# Altium project radon-sense-hardware.PrjPcb
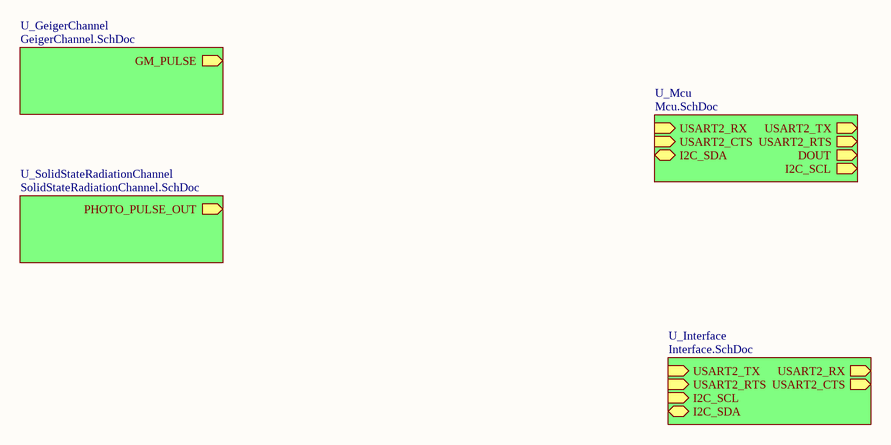
[diagram p0: SchemaBloc.SchDoc]
6 sheets, 129 parts. Net scope: hierarchical (ports join the sheet entries above them; power ports are global).
Board file: ES_Class6C_2L.PcbDoc
Sheets:
  SchemaBloc.SchDoc
    U_GeigerChannel = GeigerChannel.SchDoc
    U_SolidStateRadiationChannel = SolidStateRadiationChannel.SchDoc
    U_Mcu = Mcu.SchDoc
    U_Interface = Interface.SchDoc
  Power.SchDoc

## Sheet SchemaBloc.SchDoc
size A3; Date: 26.01.2022; Author: Ali Zoubir; CompanyName: ETML-ES; DrawnBy: Ali Zoubir; Engineer: Ali Zoubir; Organization: ETML-ES; Address1: Avenue Recordon 1; Address2: 1004 Lausanne; Address3: Switzerland; Revision: 1924B; SheetNumber: 1; SheetTotal: 4; Version: V0

### Sub-sheets
U_GeigerChannel = GeigerChannel.SchDoc: GM_PULSE (out)
U_Interface = Interface.SchDoc: USART2_TX (in), USART2_RX (out), USART2_RTS (in), USART2_CTS (out), I2C_SCL (in), I2C_SDA (bidir)
U_Mcu = Mcu.SchDoc: USART2_TX (out), USART2_RX (in), USART2_RTS (out), USART2_CTS (in), DOUT (out), I2C_SCL (out), I2C_SDA (bidir)
U_SolidStateRadiationChannel = SolidStateRadiationChannel.SchDoc: PHOTO_PULSE_OUT (out)

### Notes on the sheet
- Fichier :
- a
- Date :
- Heure :
- Version :
- Auteur :
- Modif.
- b
- c
- d
- Projet :
- No :
- Nb feuilles
- Feuille n°
- Chemin :

## Sheet GeigerChannel.SchDoc
size A3; Author: Ali Zoubir; Organization: ETML-ES; Address1: Avenue Recordon 1; Address2: 1004 Lausanne; Address3: Switzerland; Revision: 1924B; SheetNumber: 2; SheetTotal: 4; SPICEModelCacheGNAZWADN: <root> / <DocumentId>GNAZWADN</DocumentId> / </root>; Version: V0
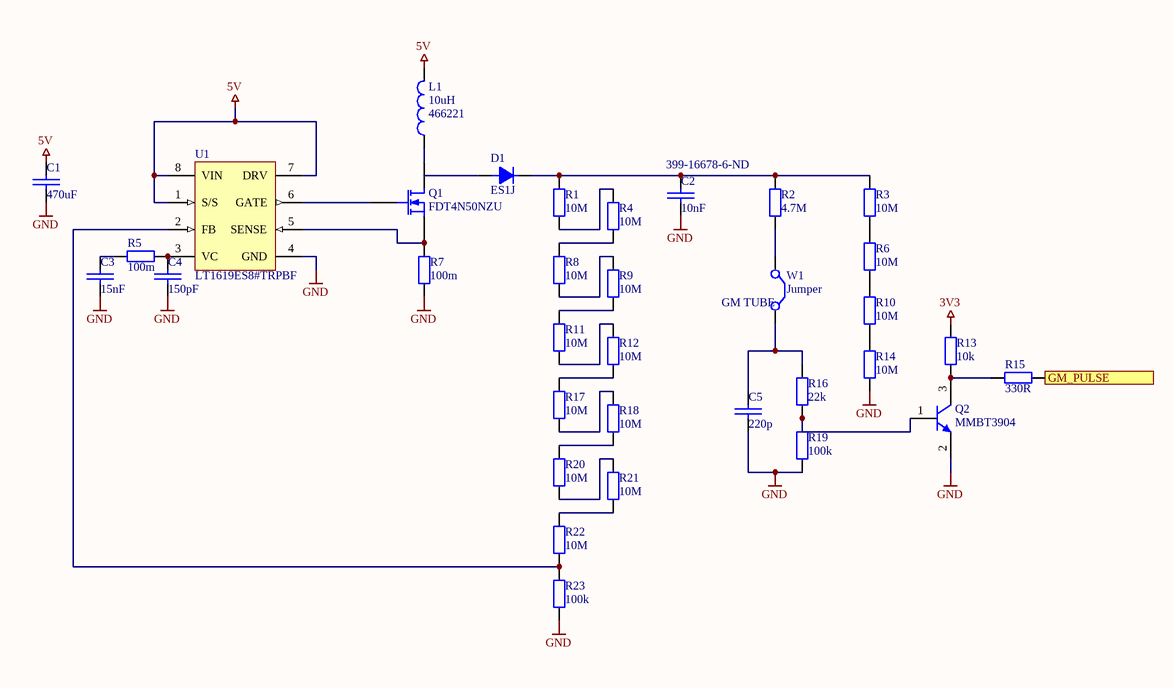
[diagram p1: GeigerChannel.SchDoc]

### Parts
C1  470uF  [Cap_0805]
C2  10nF  Supplier Part Number 1: 399-16678-6-ND  [1206]
C3  15nF  [Cap_0805]
C4  150pF  [Cap_0805]
C5  220p  [1206]
D1  ES1J  [DIOM5227X250N]
L1  10uH  Supplier Part Number 1: 466221  [SRN3015C]
Q1  FDT4N50NZU  [SOT-223]
Q2  MMBT3904  [FAIR-SOT23-3_V]
R1  10M  [RES_0805]
R2  4.7M  [RES_0805]
R3  10M  [RES_0805]
R4  10M  [RES_0805]
R5  100m  [RES_0805]
R6  10M  [RES_0805]
R7  100m  [RES_0805]
R8  10M  [RES_0805]
R9  10M  [RES_0805]
R10  10M  [RES_0805]
R11  10M  [RES_0805]
R12  10M  [RES_0805]
R13  10k  [RES_0805]
R14  10M  [RES_0805]
R15  330R  [RES_0805]
R16  22k  [RES_0805]
R17  10M  [RES_0805]
R18  10M  [RES_0805]
R19  100k  [RES_0805]
R20  10M  [RES_0805]
R21  10M  [RES_0805]
R22  10M  [RES_0805]
R23  100k  [RES_0805]
U1  LT1619ES8#TRPBF  [LT-S8-8_N]
W1  Jumper  [RAD-0.2]

### Ports
GM_PULSE (out)

### Nets
3V3: R13.1
5V: C1.1 L1.2 U1.1(S/S) U1.7(DRV) U1.8(VIN)
GND: C1.2 C2.2 C3.2 C4.2 C5.2 Q2.2(E) R7.2 R14.2 R19.2 R23.2 U1.4(GND)
NetC2_1: C2.1 D1.1(A) R1.1 R2.1 R3.1
NetC3_1: C3.1 R5.1
NetC4_1: C4.1 R5.2 U1.3(VC)
NetC5_1: C5.1 R16.1 W1.2(C2)
NetL1_1: L1.1 Q1.D
NetQ1_G: Q1.G U1.6(GATE)
NetQ1_S: Q1.S R7.1 U1.5(SENSE)
NetQ2_1: Q2.1(B) R16.2 R19.1
NetQ2_3: Q2.3(C) R13.2 R15.1
NetR1_2: R1.2 R4.1
NetR2_2: R2.2 W1.1(C1)
NetR3_2: R3.2 R6.1
NetR4_2: R4.2 R8.1
NetR6_2: R6.2 R10.1
NetR8_2: R8.2 R9.1
NetR9_2: R9.2 R11.1
NetR10_2: R10.2 R14.1
NetR11_2: R11.2 R12.1
NetR12_2: R12.2 R17.1
NetR15_2: R15.2 ; port GM_PULSE
NetR17_2: R17.2 R18.1
NetR18_2: R18.2 R20.1
NetR20_2: R20.2 R21.1
NetR21_2: R21.2 R22.1
NetR22_2: R22.2 R23.1 U1.2(FB)

Not connected (* = marked no-connect by the designer): D1 2(B)

### Notes on the sheet
- (near W1) GM TUBE
- Fichier :
- a
- Date :
- Heure :
- Version :
- Auteur :
- Modif.
- b
- c
- d
- Projet :
- No :
- Nb feuilles
- Feuille n°
- Chemin :

### Library data of the parts
C1-C5 = C: SDTSourceLibName: C:\WINDOWS\TEMP\DA.LIB; PCB Footprint: RC0805
  C2 C5: Supplier 1: DigiKey
D1 = ES1J: Ð”Ð¸Ð¾Ð´, ÑÐ²ÐµÑ€Ñ…Ð±Ñ‹ÑÑ‚Ñ€Ñ‹Ð¹, SMA, 600 Ð’, 1 Ð, 35 Ð½Ñ, 150 Â°C; MF: Diotec Semiconductor; SnapEDA_Link: https://www.snapeda.com/parts/ES1J/Diotec/view-part/?ref=snap; Package: DO-214AC Diotec; Value: *; MP: ES1J; Check_prices: https://www.snapeda.com/parts/ES1J/Diotec/view-part/?ref=eda
L1 = Inductor: Code_IEC: 1005; Published: 8-Jun-2000; LatestRevisionDate: 29-May-2009; LatestRevisionNote: IPC-7351 Footprint Added.; PackageReference: 0402-A; Publisher: Altium Limited; PackageDescription: Chip Inductor; Code_JEITA: 0402; Value: 10uH; Supplier 1: RS
Q2 = CMP-1670-00008-1: NPN General Purpose Amplifier, 40 V, 0.2 A, -55 to 150 degC, 3-Pin SOT23, RoHS, Tape and Reel; Tolerance: 30ppm; Capacitance: 1.8E-11 f; Frequency: 12.288 MHz; ESR: 40 Ohm; Load Capacitance: 18 pF; REACH SVHC: No SVHC; Pins: 4; ComponentLink3URL: http://www.fairchildsemi.com/dwg/MA/MA03D.pdf; PackageDescription: 3-Pin Small Outline Transistor, Body 2.92 x 1.325 mm, Pitch 0.95 mm; ComponentLink1URL: https://www.fairchildsemi.com/; Max Operating Temperature: 70degC; PackageReference: SOT23-3; ComponentLink1Description: Manufacturer URL; Width: 0.126 inch; Min Operating Temperature: -20degC; DatasheetVersion: Rev. 1.1.0, 10/2014; Mount: Surface Mount; Height: 0.041 inch; Package Quantity: 1000; Frequency Tolerance: 30ppm; Packaging: Tape and Reel; ComponentLink2URL: https://www.fairchildsemi.com/datasheets/MM/MMBT3904.pdf; RoHSCompliant: True; ComponentLink3Description: Package Specification; ComponentLink2Description: Datasheet; Length: 0.197 inch
R1-R23 = CMP-2001-00528-1: Res 0805; Part Number: ERJ6ENF2703V; Manufacturer: Panasonic
U1 = CMP-0491-01756-1: Low Voltage Current Mode PWM Controller, 8-pin SOIC (S8-8), -40 to 85 degC, Pb-Free, Tape and Reel; Manufacturer: Linear Technology; Number of Outputs: 1; ComponentLink1Description: Manufacturer URL; Packing: Tape and Reel; ComponentLink2Description: Datasheet; ComponentLink2URL: http://cds.linear.com/docs/en/datasheet/1619fa.pdf; ComponentLink1URL: http://www.linear.com/; Mounting Technology: Surface Mount; RoHS: TRUE; ComponentLink3URL: http://cds.linear.com/docs/en/packaging/05081610_G_SO8.pdf; PackageReference: S8-8; PackageVersion: Rev. G, 03/2012; DatasheetVersion: Rev. A; ComponentLink3Description: Package Specification; PartNumber: LT1619ES8#TRPBF; PackageDescription: 8-Pin Plastic Small Outline (Narrow .150 Inch), Body 4.9 x 3.9 mm, Pitch 1.27 mm
W1 = Jumper: Jumper Wire; Published: 24-Mar-1999; LatestRevisionDate: 17-Jul-2002; LatestRevisionNote: Re-released for DXP Platform.; PackageReference: RAD-0.2; Publisher: Altium Limited; PackageDescription: Radial Cap, Thru-Hole; 2 Leads; 0.2 in Pin Spacing

## Sheet SolidStateRadiationChannel.SchDoc
size A3; Author: Ali Zoubir; Organization: ETML-ES; Address1: Avenue Recordon 1; Address2: 1004 Lausanne; Address3: Switzerland; Revision: 1924B; SheetNumber: 3; SheetTotal: 4; Version: V0
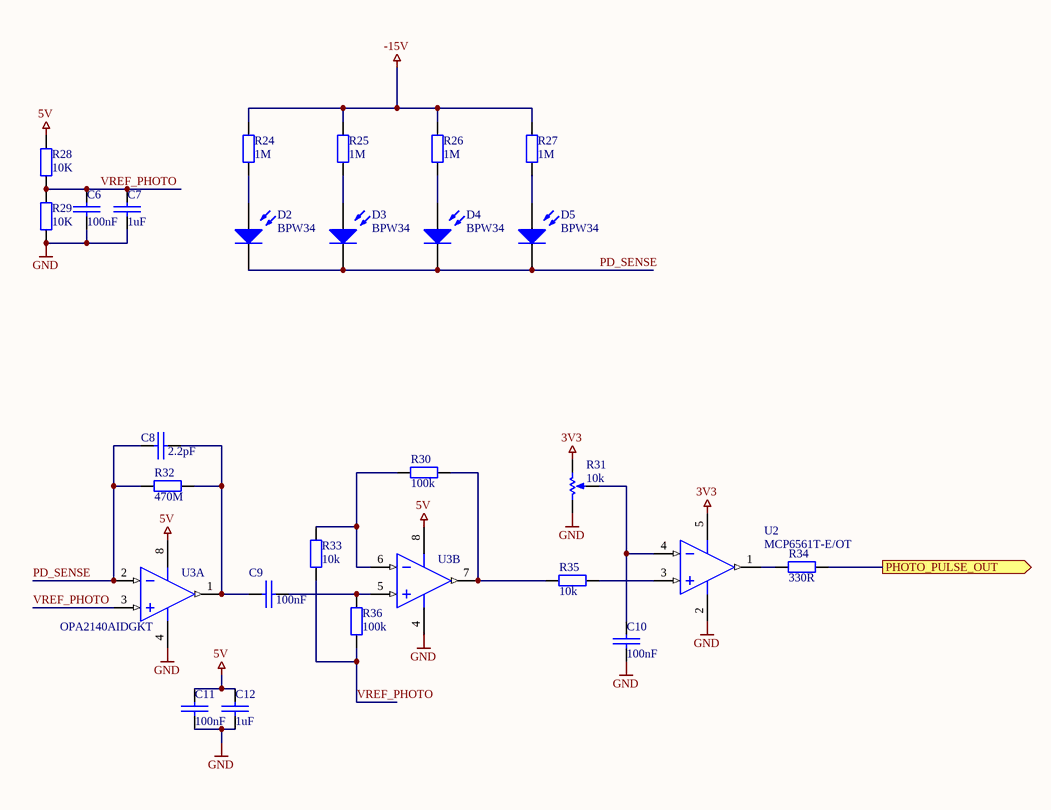
[diagram p2: SolidStateRadiationChannel.SchDoc]

### Parts
C6  100nF  [Cap_0805]
C7  1uF  [Cap_0805]
C8  2.2pF  [Cap_0805]
C9  100nF  [Cap_0805]
C10  100nF  [Cap_0805]
C11  100nF  [Cap_0805]
C12  1uF  [Cap_0805]
D2  BPW34  [BPW34]
D3  BPW34  [BPW34]
D4  BPW34  [BPW34]
D5  BPW34  [BPW34]
R24  1M  [RES_0805]
R25  1M  [RES_0805]
R26  1M  [RES_0805]
R27  1M  [RES_0805]
R28  10K  [RES_0805]
R29  10K  [RES_0805]
R30  100k  [RES_0805]
R31  10k  [VR5]
R32  470M  [RES_0805]
R33  10k  [RES_0805]
R34  330R  [RES_0805]
R35  10k  [RES_0805]
R36  100k  [RES_0805]
U2  MCP6561T-E/OT  [SOT-23-OT5_L]
U3  OPA2140AIDGKT  [DGK0008A_N]  (parts A,B of 2)

### Ports
PHOTO_PULSE_OUT (out)

### Nets
3V3: R31.1(TOP) U2.5(VDD)
5V: C11.1 C12.1 R28.1 U3.8(V+)
-15V: R24.1 R25.1 R26.1 R27.1
GND: C6.2 C7.2 C10.1 C11.2 C12.2 R29.2 R31.2(BOT) U2.2(VSS) U3.4(V-)
PD_SENSE: C8.1 D2.2(K) D3.2(K) D4.2(K) D5.2(K) R32.1 U3.2(IN_A-)
VREF_PHOTO: C6.1 C7.1 R28.2 R29.1 R33.2 R36.2 U3.3(IN_A+)
NetC8_2: C8.2 C9.1 R32.2 U3.1(OUT_A)
NetC9_2: C9.2 R36.1 U3.5(IN_B+)
NetC10_2: C10.2 R31.3(TAP) U2.4(IN-)
NetD2_1: D2.1(A) R24.2
NetD3_1: D3.1(A) R25.2
NetD4_1: D4.1(A) R26.2
NetD5_1: D5.1(A) R27.2
NetR30_1: R30.1 R33.1 U3.6(IN_B-)
NetR30_2: R30.2 R35.1 U3.7(OUT_B)
NetR34_1: R34.1 U2.1(OUT)
NetR34_2: R34.2 ; port PHOTO_PULSE_OUT
NetR35_2: R35.2 U2.3(IN+)

### Notes on the sheet
- Fichier :
- a
- Date :
- Heure :
- Version :
- Auteur :
- Modif.
- b
- c
- d
- Projet :
- No :
- Nb feuilles
- Feuille n°
- Chemin :

### Library data of the parts
C6-C12 = C: as C1 on sheet GeigerChannel
D2-D5 = BPW34: Silicon PIN Photodiode
R24-R30 R32-R36 = CMP-2001-00528-1: as R1 on sheet GeigerChannel
R31 = RPot: Potentiometer; Sim Note: Enter the Resistance value and the set point into parameter fields.; Set Position: 0.5; Published: 8-Jun-2000; LatestRevisionDate: 17-Jul-2002; LatestRevisionNote: Re-released for DXP Platform.; PackageReference: VR5; Publisher: Altium Limited; PackageDescription: Variable Resistor, Thru-Hole; 3 Leads; Value: 10k
U2 = CMP-0187-00042-3: None; Input Bias Current: 1pA; Hysteresis: 5mV; Output Type: TTL; Propagation Delay: 80ns; Output Current per Channel: 25mA; Max Supply Voltage: 5.5V; Power Supply Rejection Ratio (PSRR): 70dB; Response Time: 49ns; Nominal Supply Current: 130uA; Common Mode Rejection Ratio: 66dB; Natural Thermal Resistance: 256°C/W; Number of Elements: 1; Input Offset Voltage (Vos): 10mV; Output Current: 50mA; Min Supply Voltage: 1.8V; Case/Package: SOT-23; Packaging: Tape and Reel; Radiation Hardening: No; Width: 1.8mm; RoHS Compliant: Yes; Package Quantity: 3000; Min Operating Temperature: -40°C; Lead Free: Lead Free; Technology: CMOS; Max Operating Temperature: 125°C; Mount: Surface Mount; REACH SVHC: No SVHC; Max Supply Current: 130uA; Length: 3.1mm; Type: General Purpose; Number of Pins: 5; Contact Plating: Tin; Number of Channels: 1; Height: 1.3mm; Quiescent Current: 130uA; Max Input Current: 1pA; Supply Current: 130uA; Turn-On Delay Time: 49ns
U3 = CMP-0272-01237-3: 11 MHz, Precision, Low Noise, Rail-to-Rail Output, JFET Operational Amplifier, 4.5 to 36 V, -40 to 125 degC, 8-pin SOP (DGK8), Green (RoHS & no Sb/Br); Manufacturer: Texas Instruments; Offset Drift(Typ)(uV/C): 0.35; Rating: Catalog; GBW(Typ)(MHz): 11; Total Supply Voltage(Min)(+5V is 5, +/-5V is 10): 4.5; Slew Rate(Typ)(V/us): 20; Vio (25C)(Max)(mV): 0.12; Total Supply Voltage(Max)(+5V is 5, +/-5V is 10): 36; CMRR(Min)(dB): 126; Iq per channel(Max)(mA): 2; Packing: SMALL T&R; Sub Family: High Supply Voltage Amplifier (>=30V), Low Input Bias Current Amp (<=10pA), Low Noise Amp (<=10nV/rtHz), Low Offset Voltage Amplifier (<=500uV), Precision Amplifier; IIB(Max)(pA): 10; ComponentLink2URL: http://www.ti.com/lit/ds/symlink/opa2140.pdf; Eco-Plan: Green (RoHS & no Sb/Br); ComponentLink1Description: Manufacturer URL; ComponentLink2Description: Datasheet; Code_JEDEC: MO-187; ComponentLink3Description: Package Specification; PackageReference: DGK0008A; PartNumber: OPA2140AIDGKT; ComponentLink3URL: http://www.ti.com/litv/pdf/mpds028d; PackageDescription: 8-Pin Thin Small Outline, Body 3 x 3 mm, Pitch 0.65 mm; PackageVersion: 4073329/E, 05/2006; DatasheetVersion: SBOS498A; Number of Channels: 2; ComponentLink1URL: http://www.ti.com/; Mounting Technology: Surface Mount

## Sheet Mcu.SchDoc
size A4
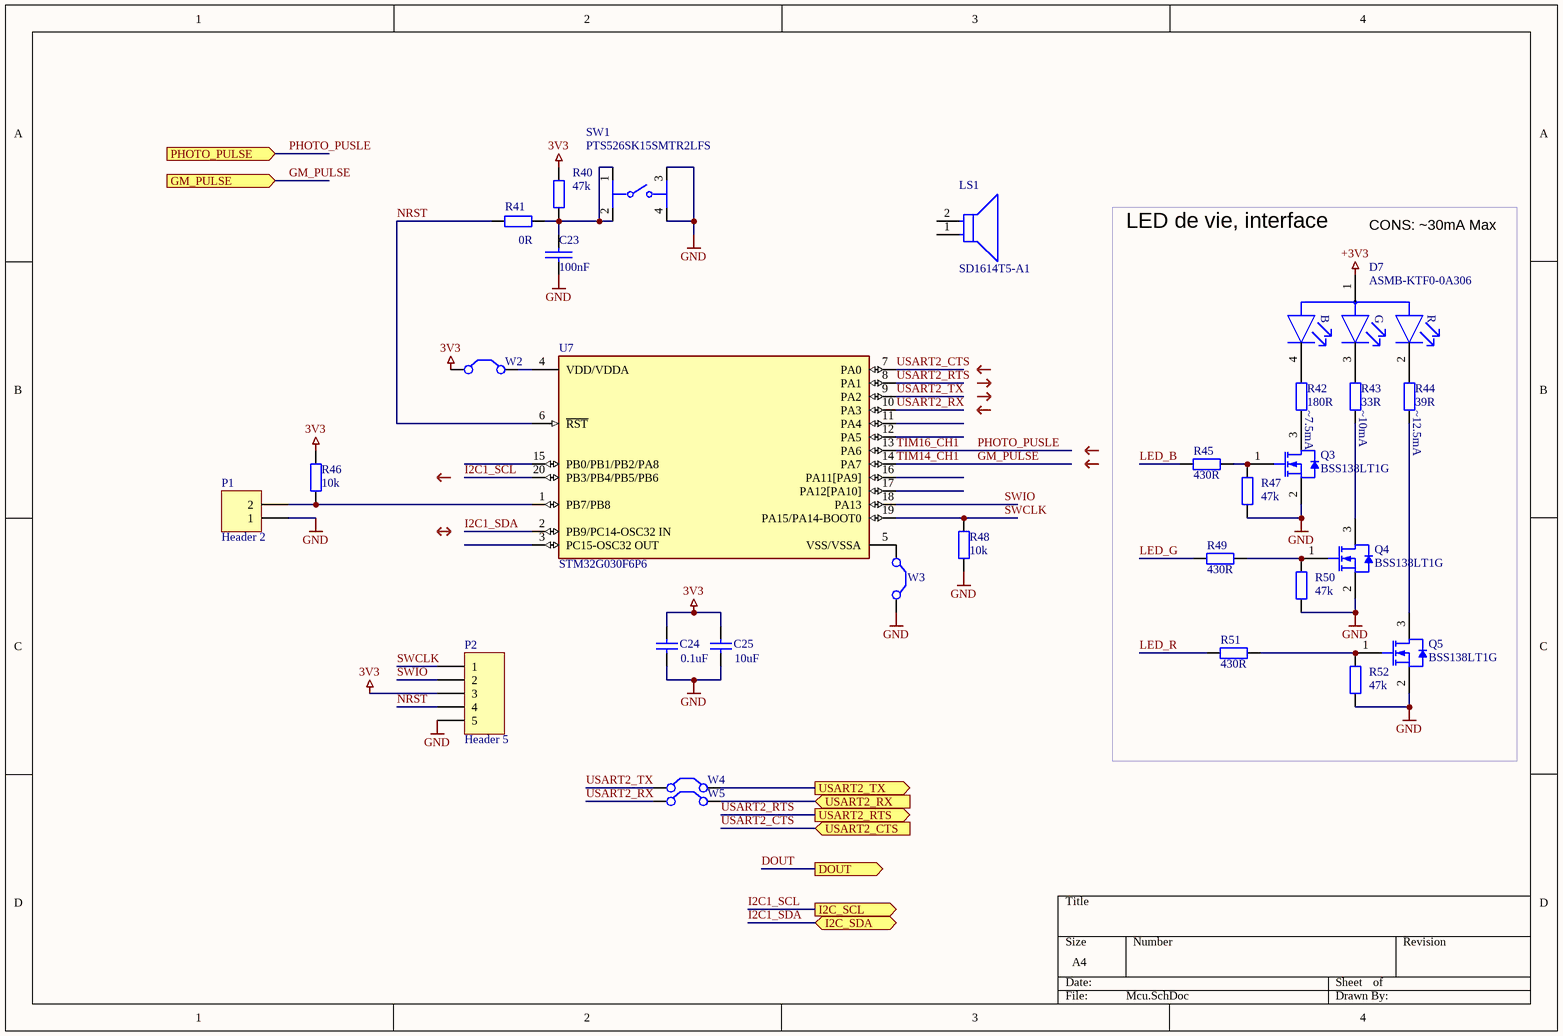
[diagram p3: Mcu.SchDoc]

### Parts
C23  100nF  [Cap_0805]
C24  0.1uF  [Cap_0805]
C25  10uF  [Cap_0805]
D7  ASMB-KTF0-0A306  [FP-PLCC-4-MFG]
LS1  SD1614T5-A1  [FP-SD1614T5-A1-MFG]
P1  Header 2  [HDR1X2]
P2  Header 5  [HDR1X5]
Q3  BSS138LT1G  [ONSC-SOT-23-3-318-08_V]
Q4  BSS138LT1G  [ONSC-SOT-23-3-318-08_V]
Q5  BSS138LT1G  [ONSC-SOT-23-3-318-08_V]
R40  47k  [RES_0805]
R41  0R  [RES_0805]
R42  value 180R  [RES_0805]  (hidden comment: 430R)
R43  value 33R  [RES_0805]  (hidden comment: 430R)
R44  value 39R  [RES_0805]  (hidden comment: 430R)
R45  430R  [RES_0805]
R46  10k  [RES_0805]
R47  value 47k  [RES_0805]  (hidden comment: 10k)
R48  10k  [RES_0805]
R49  430R  [RES_0805]
R50  value 47k  [RES_0805]  (hidden comment: 10k)
R51  430R  [RES_0805]
R52  value 47k  [RES_0805]  (hidden comment: 10k)
SW1  PTS526SK15SMTR2LFS  [FP-PTS526SK15SMTR2LFS-MFG]
U7  STM32G030F6P6  [FP-TSSOP20-YA-MFG]
W2  Jumper  [JUMPER]  (value not drawn)
W3  Jumper  [JUMPER]  (value not drawn)
W4  Jumper  [JUMPER]  (value not drawn)
W5  Jumper  [JUMPER]  (value not drawn)

### Blocks framed on the sheet
LED de vie, interface: D7 Q3-Q5 R42-R45 R47 R49-R52

### Ports
DOUT (out), GM_PULSE (in), I2C_SCL (out), I2C_SDA (bidir), PHOTO_PULSE (in), USART2_CTS (in), USART2_RTS (out), USART2_RX (in), USART2_TX (out)

### Nets
3V3: C24.2 C25.2 P2.3 R40.1 R46.2 W2.1(C1)
+3V3: D7.1(A)
GND: C23.2 C24.1 C25.1 P1.1 P2.5 Q3.2(S) Q4.2(S) Q5.2(S) R47.1 R48.1 R50.1 R52.1 SW1.3 SW1.4 W3.2(C2)
DOUT: port DOUT
GM_PULSE: U7.14(PA7) ; port GM_PULSE  [also labelled TIM14_CH1]
I2C1_SCL: U7.20(PB3/PB4/PB5/PB6) ; port I2C_SCL
I2C1_SDA: U7.2(PB9/PC14-OSC32_IN) ; port I2C_SDA
LED_B: R45.2
LED_G: R49.2
LED_R: R51.2
NRST: P2.4 R41.1 U7.6(~{RST})
PHOTO_PUSLE: U7.13(PA6) ; port PHOTO_PULSE  [also labelled TIM16_CH1]
SWCLK: P2.1 R48.2 U7.19(PA15/PA14-BOOT0)
SWIO: P2.2 U7.18(PA13)
USART2_CTS: U7.7(PA0) ; port USART2_CTS
USART2_RTS: U7.8(PA1) ; port USART2_RTS
USART2_RX: U7.10(PA3) W5.1(C1)
USART2_TX: U7.9(PA2) W4.1(C1)
NetC23_1: C23.1 R40.2 R41.2 SW1.1 SW1.2
NetD7_2: D7.2(Red_C) R44.1
NetD7_3: D7.3(Green_C) R43.1
NetD7_4: D7.4(Blue_C) R42.1
NetP1_2: P1.2 R46.1 U7.1(PB7/PB8)
NetQ3_1: Q3.1(G) R45.1 R47.2
NetQ3_3: Q3.3(D) R42.2
NetQ4_1: Q4.1(G) R49.1 R50.2
NetQ4_3: Q4.3(D) R43.2
NetQ5_1: Q5.1(G) R51.1 R52.2
NetQ5_3: Q5.3(D) R44.2
NetU7_4: U7.4(VDD/VDDA) W2.2(C2)
NetU7_5: U7.5(VSS/VSSA) W3.1(C1)
NetW4_2: W4.2(C2) ; port USART2_TX
NetW5_2: W5.2(C2) ; port USART2_RX

Not connected (* = marked no-connect by the designer): LS1 1(C) 2(A); U7 3(PC15-OSC32_OUT) 11(PA4) 12(PA5) 15(PB0/PB1/PB2/PA8) 16(PA11[PA9]) 17(PA12[PA10])

### Notes on the sheet
- CONS: ~30mA Max
- ~7.5mA
- (near R43) ~10mA
- (near R44) ~12.5mA
- (in symbol CMP-18399-000003-1) B; G; R

### Library data of the parts
C23 = C: as C1 on sheet GeigerChannel
C24 C25 = Cap: Capacitor; Published: 8-Jun-2000; LatestRevisionDate: 17-Jul-2002; LatestRevisionNote: Re-released for DXP Platform.; PackageReference: RAD-0.3; Publisher: Altium Limited; PackageDescription: Radial Cap, Thru-Hole; 2 Leads; 0.3 in Pin Spacing
  C24: Value: 0.1uF
  C25: Value: 10uF
D7 = CMP-18399-000003-1: LED RGB 4PLCC SMD; Manufacturer: Broadcom; Peak Emmision Wavelength: 467/518/628nm; Luminous Intensity: 215/1100/490mcd; Power Dissipation: 66/66/48mW; Led Orientation: Top View; Colour: Blue, Green, Red; Wavelength: 471/524/620nm; Forward Current: 10/15/15mA; Reverse Voltage: 4V; Viewing Angle: 110°; Forward Voltage: 2.85/2.95/2V; Max Junction Temp: +100°C; Digikey Description: LED RGB 4PLCC SMD; ComponentLink2URL: https://docs.broadcom.com/docs/ASMB-KTF0-0A306-DS100; ComponentLink2Description: Datasheet; Manufacturer Part Number: ASMB-KTF0-0A306; Temperature Range Low: -40°C; Device Class L2: LEDs; RoHS: TRUE; Octopart: https://octopart.com/asmb-ktf0-0a306-broadcom-87157377; Package: PLCC-4; Mouser Description: LED Multi-Color Chip Red/Green/Blue 620nm/524nm/471nm 20mA 4-Pin PLCC T/R; Category: Diode; Lead Free: Yes; Height: 2.1mm; Temperature: -40°C to +85°C; Device Class L1: Optoelectronics; Automotive: No; Temperature Range High: +85°C; Device Class L3: unset
LS1 = CMP-08413-000005-1: BUZZER MAGNETIC 5V 80DB 2048HZ 1; Frequency: 2.048kHz; Operating Supply Current: 80mA; Max Operating Temperature: 85°C; Min Operating Temperature: -40°C; Voltage Rating: 5V; Termination: PC Pins; Sensing Method: Magnetic; Mount: Panel
P1 = Header 2: Header, 2-Pin; LatestRevisionDate: 17-Jul-2002; LatestRevisionNote: Re-released for DXP Platform.; Publisher: Altium Limited
P2 = Header 5: Header, 5-Pin; LatestRevisionDate: 17-Jul-2002; LatestRevisionNote: Re-released for DXP Platform.; Publisher: Altium Limited
Q3-Q5 = CMP-1058-00767-1: Power MOSFET, 200 mA, 50 V, N-Channel, 3-Pin SOT-23, Pb-Free, Tape and Reel; Manufacturer: On Semiconductor; PD Max (W): 0.225; Coss Typ (pF): 12; V(BR)DSS Min (V): 50; VGS Max (V): 20; Channel Polarity: N Channel; Configuration: Single; VGS(th) Max (V): 1.5; Ciss Typ (pF): 40; Crss Typ (pF): 3.5; ID Max (A): 0.2; ComponentLink3Description: Package Specification; PackageDescription: 3-Pin Small Outline Transistor, Body 2.92 x 1.3 mm, Pitch 0.95 mm; PackageReference: SOT-23-3-318-08; RoHS: Pb-Free; Mounting Technology: Surface Mount; ComponentLink1Description: Manufacturer URL; ComponentLink2URL: http://www.onsemi.com/pub_link/Collateral/BSS138LT1-D.PDF; ComponentLink2Description: Datasheet; Packing: Tape and Reel; PackageVersion: Rev. AP, 11/2009; PartNumber: BSS138LT1G; Package Type: SOT-23-3; ComponentLink1URL: http://www.onsemi.com/; DatasheetVersion: Rev. 8; ComponentLink3URL: http://www.onsemi.cn/pub_link/Collateral/318-08.PDF
R40 R41 = Res2: Res 0805; Value: 1K; Published: 8-Jun-2000; LatestRevisionDate: 17-Jul-2002; LatestRevisionNote: Re-released for DXP Platform.; PackageReference: AXIAL-0.4; Publisher: Altium Limited; PackageDescription: Axial Device, Thru-Hole; 2 Leads; 0.4 in Pin Spacing
R42-R45 R47 R49-R52 = Res2: Res 0805; Published: 8-Jun-2000; LatestRevisionDate: 17-Jul-2002; LatestRevisionNote: Re-released for DXP Platform.; PackageReference: AXIAL-0.4; Publisher: Altium Limited; PackageDescription: Axial Device, Thru-Hole; 2 Leads; 0.4 in Pin Spacing
  R45 R49 R51: Value: 430R
R46 R48 = Res2: Resistor; Published: 8-Jun-2000; LatestRevisionDate: 17-Jul-2002; LatestRevisionNote: Re-released for DXP Platform.; PackageReference: AXIAL-0.4; Publisher: Altium Limited; PackageDescription: Axial Device, Thru-Hole; 2 Leads; 0.4 in Pin Spacing; Value: 10k
SW1 = CMP-10040-000013-1: TACT 5.2 X 5.2, 1.5 MM H, 260GF,; Manufacturer: C&K; Operating Force: 250gf; Throw Configuration: SPST-NO; Contact Current Rating: 50mA; Standoff Height: 0mm; Contact Resistance: 100mΩ; Voltage Rating Dc: 12V; Electromechanical Life: 200000Cycles; Device Class L3: Tactile Switches; Device Class L2: Switches; Temperature: -20°C to +70°C; Temperature Range Low: -20°C; Package: PTS526SK15SMTR2LFS; Temperature Range High: +70°C; ComponentLink2Description: Datasheet; Device Class L1: Electromechanical; Height: 1.65mm; Digikey Description: TACT 5.2 X 5.2, 1.5 MM H, 260GF,; Category: Switch; RoHS: TRUE; Automotive: No; Lead Free: Yes; Manufacturer Part Number: PTS526SK15SMTR2LFS; Octopart: https://octopart.com/pts526+sk15+smtr2+lfs-c%26k+components-100617999; ComponentLink2URL: https://www.ckswitches.com/media/2780/pts526.pdf
U7 = CMP-12105-000034-1: ARM MICROCONTROLLERS - MCU; Manufacturer: STMicroelectronics; Max Supply Voltage: 3.6V; Interface: I2C,SPI,USART,LIN,IrDA,I2S,SMBus; Memory Size: 32KBytes; Number Of I/Os: 17; Number Of Timers/Counters: 6; Core Architecture: ARM Cortex-M0+; Number Of Pwm Channels: 11; Standoff Height: 0.05mm; Number Of A/D Converters: 1; Number Of I2C Channels: 2; Data Bus Width: 32bits; Ram Size: 8KBytes; Max Junction Temp: +105°C; Number Of Spi Channels: 3; Min Supply Voltage: 2V; Number Of Adc Channels: 16; Memory Type: FLASH; Frequency: 64MHz; Ambient Temperature Range Low: -40°C; ComponentLink2URL: https://www.st.com/resource/en/datasheet/stm32g030f6.pdf; Temperature Range Low: -40°C; Automotive: No; Device Class L1: Integrated Circuits (ICs); Category: IC; Temperature Range High: +85°C; ComponentLink2Description: Datasheet; Device Class L2: Embedded Processors and Controllers; Manufacturer Part Number: STM32G030F6P6; Height: 1.2mm; Ambient Temperature Range High: +85°C; Octopart: https://octopart.com/stm32g030f6p6-stmicroelectronics-103773023; Package: TSSOP20-YA; Temperature: -40°C to +85°C; Lead Free: Yes; Device Class L3: Microcontrollers; Number Of Uart Channels: 2; RoHS: TRUE; Number Of Cores: 1; Digikey Description: ARM MICROCONTROLLERS - MCU
W2-W5 = Jumper: Jumper Wire; Published: 24-Mar-1999; LatestRevisionDate: 17-Jul-2002; LatestRevisionNote: Re-released for DXP Platform.; PackageReference: RAD-0.2; Publisher: Altium Limited; PackageDescription: Radial Cap, Thru-Hole; 2 Leads; 0.2 in Pin Spacing

## Sheet Interface.SchDoc
size A4
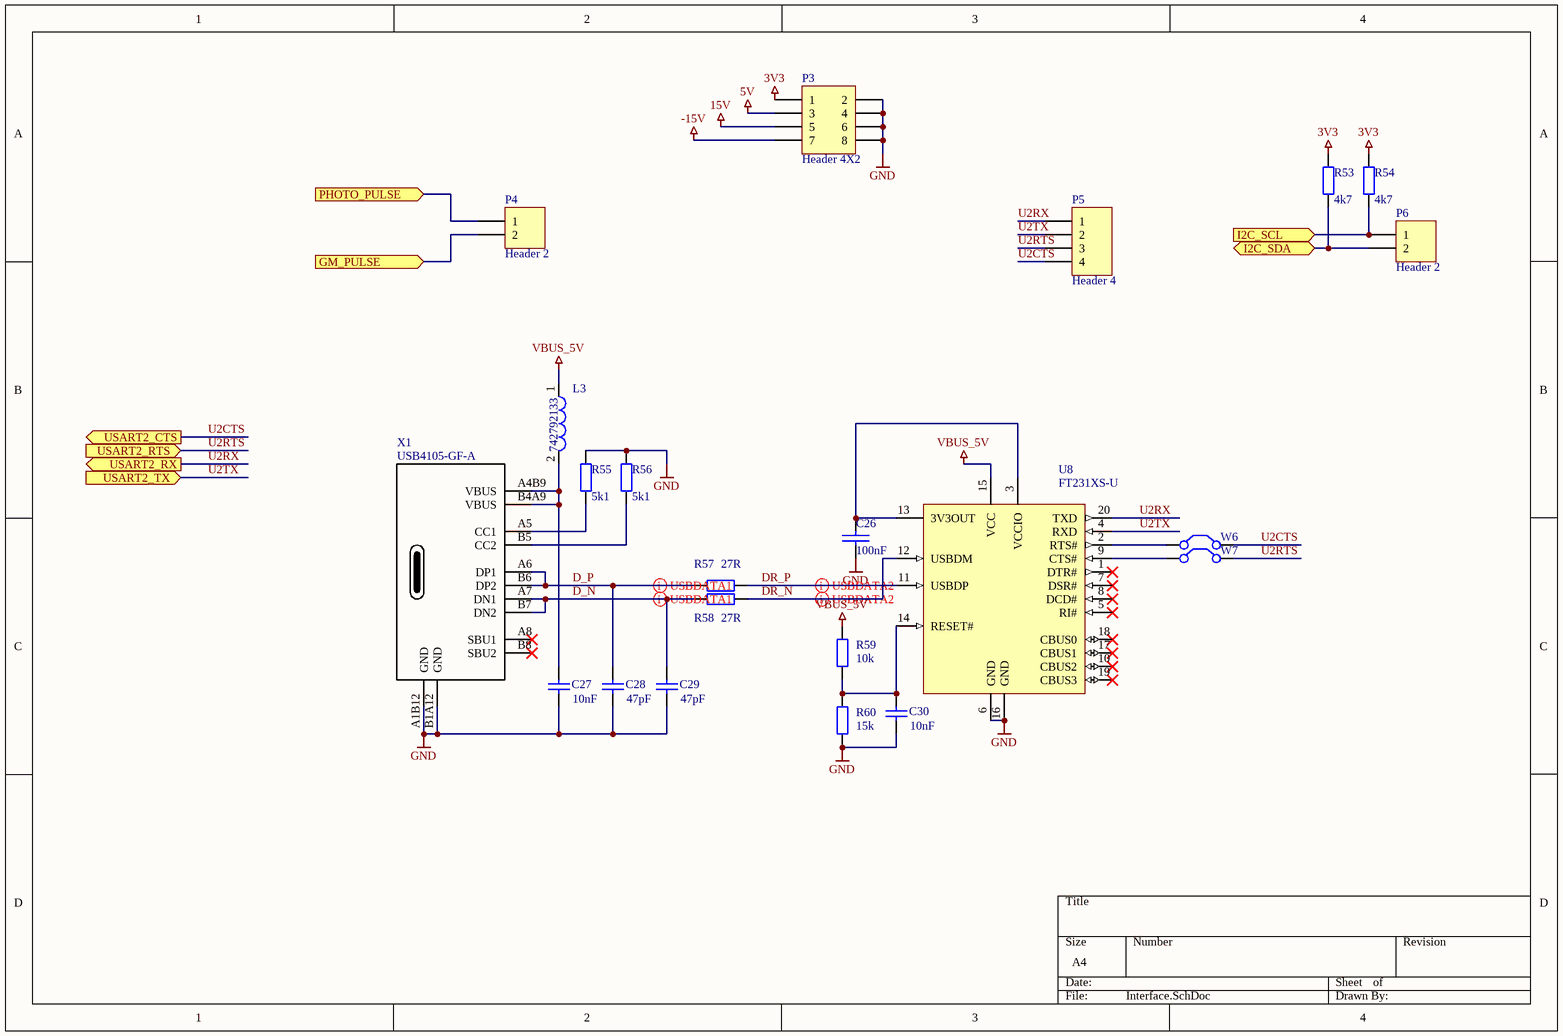
[diagram p4: Interface.SchDoc]

### Parts
C26  100nF  [Cap_0805]
C27  10nF  [6-0805_L]
C28  47pF  [6-0805_L]
C29  47pF  [6-0805_L]
C30  10nF  [Cap_0805]
L3  742792133  [SMD-1206]
P3  Header 4X2  [HDR2X4]
P4  Header 2  [HDR1X2]
P5  Header 4  [HDR1X4]
P6  Header 2  [HDR1X2]
R53  value 4k7  [RES_0805]  (hidden comment: 5k1)
R54  value 4k7  [RES_0805]  (hidden comment: 5k1)
R55  5k1  [RES_0805]
R56  5k1  [RES_0805]
R57  27R  [RES_0805]
R58  27R  [RES_0805]
R59  10k  [RES_0805]
R60  15k  [RES_0805]
U8  FT231XS-U  [SSOP-20_M]
W6  Jumper  [JUMPER]  (value not drawn)
W7  Jumper  [JUMPER]  (value not drawn)
X1  USB4105-GF-A  [GCT_USB4105-GF-A]

### Ports
GM_PULSE (in), I2C_SCL (in), I2C_SDA (bidir), PHOTO_PULSE (in), USART2_CTS (out), USART2_RTS (in), USART2_RX (out), USART2_TX (in)

### Nets
3V3: P3.1 R53.2 R54.2
5V: P3.3
15V: P3.5
-15V: P3.7
GND: C26.2 C27.1 C28.1 C29.1 C30.1 P3.2 P3.4 P3.6 P3.8 R55.2 R56.2 R60.1 U8.6(GND) U8.16(GND) X1.A1B12(GND) X1.B1A12(GND)
VBUS_5V: L3.1 R59.2 U8.15(VCC)
D_N: C29.2 R58.1 X1.A7(DN1) X1.B7(DN2)
D_P: C28.2 R57.1 X1.A6(DP1) X1.B6(DP2)
DR_N: R58.2 U8.12(USBDM)
DR_P: R57.2 U8.11(USBDP)
U2CTS: P5.4 W6.2(C2) ; port USART2_CTS
U2RTS: P5.3 W7.2(C2) ; port USART2_RTS
U2RX: P5.1 U8.20(TXD) ; port USART2_RX
U2TX: P5.2 U8.4(RXD) ; port USART2_TX
NetC26_1: C26.1 U8.3(VCCIO) U8.13(3V3OUT)
NetC27_2: C27.2 L3.2 X1.A4B9(VBUS) X1.B4A9(VBUS)
NetC30_2: C30.2 R59.1 R60.2 U8.14(RESET#)
NetP4_1: P4.1 ; port PHOTO_PULSE
NetP4_2: P4.2 ; port GM_PULSE
NetP6_1: P6.1 R54.1 ; port I2C_SCL
NetP6_2: P6.2 R53.1 ; port I2C_SDA
NetR55_1: R55.1 X1.A5(CC1)
NetR56_1: R56.1 X1.B5(CC2)
NetU8_2: U8.2(RTS#) W6.1(C1)
NetU8_9: U8.9(CTS#) W7.1(C1)

Not connected (* = marked no-connect by the designer): U8 1(DTR#)* 5(RI#)* 7(DSR#)* 8(DCD#)* 10(CBUS2)* 17(CBUS1)* 18(CBUS0)* 19(CBUS3)*; X1 A8(SBU1)* B8(SBU2)*

### Layout directives
differential pair: D_N, D_P, DR_N, DR_P

### Library data of the parts
C26 = C: as C1 on sheet GeigerChannel
C27-C30 = Cap: Capacitor; Published: 8-Jun-2000; LatestRevisionDate: 17-Jul-2002; LatestRevisionNote: Re-released for DXP Platform.; PackageReference: RAD-0.3; Publisher: Altium Limited; PackageDescription: Radial Cap, Thru-Hole; 2 Leads; 0.3 in Pin Spacing
  C27 C30: Value: 10nF
  C28 C29: Value: 47pF
L3 = CMP-0220-00010-1: SMD EMI Suppression Ferrite Bead WE-CBF, Z = 600 Ohm; Impedance: 600 Ohm; ComponentLink1Description: Manufacturer Link; DatasheetVersion: ver 2, Aug-2007; ComponentLink1URL: http://www.we-online.com; PackageDescription: Chip Inductor, 2-Leads, Body 3.2 x 1.6 mm; ComponentLink2URL: http://www.we-online.de/katalog/media/pdf/742792133.pdf; PackageVersion: 2007; PackageReference: SMD-1206; ComponentLink2Description: Datasheet
P3 = Header 4X2: Header, 4-Pin, Dual row; LatestRevisionDate: 17-Jul-2002; LatestRevisionNote: Re-released for DXP Platform.; Publisher: Altium Limited
P4 P6 = Header 2: Header, 2-Pin; LatestRevisionDate: 17-Jul-2002; LatestRevisionNote: Re-released for DXP Platform.; Publisher: Altium Limited
P5 = Header 4: Header, 4-Pin; LatestRevisionDate: 17-Jul-2002; LatestRevisionNote: Re-released for DXP Platform.; Publisher: Altium Limited
R53-R60 = Res2: Res 0805; Published: 8-Jun-2000; LatestRevisionDate: 17-Jul-2002; LatestRevisionNote: Re-released for DXP Platform.; PackageReference: AXIAL-0.4; Publisher: Altium Limited; PackageDescription: Axial Device, Thru-Hole; 2 Leads; 0.4 in Pin Spacing
  R55 R56: Value: 5k1
  R57 R58: Value: 27R
  R59: Value: 10k
  R60: Value: 15k
U8 = CMP-0248-00015-2: USB to Full-Handshake UART Interface Chip, UHCI/OHCI/EHCI Compatible, USB 2.0 Compatible, -40 to +85 degC, 20-Pin SSOP, Pb-Free, Tube; Manufacturer: FTDI; PackageDescription: 20-Pin Small Outline Package, 8.6 x 3.9 mm Body, 0.635 mm Pitch; ComponentLink2Description: Datasheet; DatasheetVersion: ver 1.2, Feb-2013; PackageReference: SSOP-20; ComponentLink3URL: www.ftdichip.com/Products/ICs/FT231X.html; ComponentLink2URL: http://www.ftdichip.com/Support/Documents/DataSheets/ICs/DS_FT231X.pdf; PartNumber: FT231XS-U; ComponentLink3Description: FT231X Product Page; ComponentLink1URL: http://www.ftdichip.com/; Code_JEDEC: MO-137-AD; ComponentLink1Description: Manufacturer URL; RevisionNote: DatasheetVersion updated to 1.2 Feb-2013; PackageVersion: Feb-13
W6 W7 = Jumper: Jumper Wire; Published: 24-Mar-1999; LatestRevisionDate: 17-Jul-2002; LatestRevisionNote: Re-released for DXP Platform.; PackageReference: RAD-0.2; Publisher: Altium Limited; PackageDescription: Radial Cap, Thru-Hole; 2 Leads; 0.2 in Pin Spacing
X1 = USB-C Type 2.0: USB4105-GF-A USB connector; ComponentLink1Description: LCSC  C319148; ComponentLink1URL: https://lcsc.com/product-detail/USB-Connectors_XKB-Connectivity-U262-161N-4BVC11_C319148.html; Supplier 1: LCSC; Supplier Part Number 1: C319148

## Sheet Power.SchDoc
size A3; Author: Ali Zoubir; Organization: ETML-ES; Address1: Avenue Recordon 1; Address2: 1004 Lausanne; Address3: Switzerland; Revision: 1924B; SheetNumber: 4; SheetTotal: 4; Version: V0
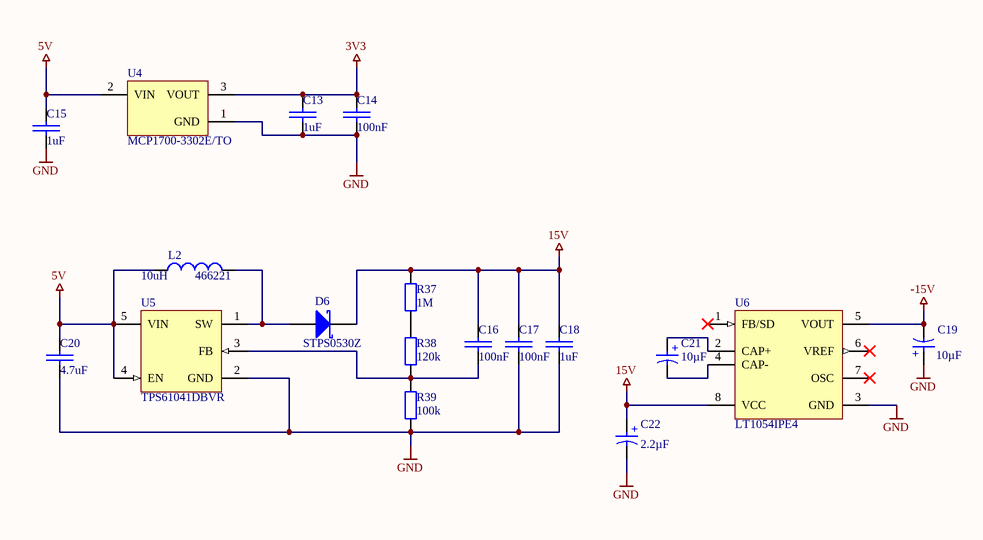
[diagram p5: Power.SchDoc]

### Parts
C13  1uF  [Cap_0805]
C14  100nF  [Cap_0805]
C15  1uF  [Cap_0805]
C16  100nF  [Cap_0805]
C17  100nF  [Cap_0805]
C18  1uF  [Cap_0805]
C19  Capacitance: 10µF  [WCAP-ASLI_D5H5.5]  (hidden comment: 865080642006)
C20  4.7uF  [Cap_0805]
C21  Capacitance: 10µF  [WCAP-ASLI_D5H5.5]  (hidden comment: 865080642006)
C22  Capacitance: 2.2µF  [WCAP-ASLL_D4H5.5]  (hidden comment: 865060640002)
D6  STPS0530Z  [SOD-123]
L2  10uH  Supplier Part Number 1: 466221  [SRN3015C]
R37  1M  [RES_0805]
R38  120k  [RES_0805]
R39  100k  [RES_0805]
U4  MCP1700-3302E/TO  [TO-92-TO3]
U5  TPS61041DBVR  [DBV0005A_M]
U6  LT1054IPE4  [TI-P8]

### Nets
3V3: C13.1 C14.1 U4.3(VOUT)
5V: C15.1 C20.1 L2.1 U4.2(VIN) U5.4(EN) U5.5(VIN)
15V: C16.1 C17.1 C18.1 C22.1(P) D6.K R37.1 U6.8(VCC)
-15V: C19.2(N) U6.5(VOUT)
GND: C13.2 C14.2 C15.2 C17.2 C18.2 C19.1(P) C20.2 C22.2(N) R39.2 U4.1(GND) U5.2(GND) U6.3(GND)
NetC16_2: C16.2 R38.2 R39.1 U5.3(FB)
NetC21_1: C21.1(P) U6.2(CAP+)
NetC21_2: C21.2(N) U6.4(CAP-)
NetD6_A: D6.A L2.2 U5.1(SW)
NetR37_2: R37.2 R38.1

Not connected (* = marked no-connect by the designer): U6 1(FB/SD)* 6(VREF)* 7(OSC)*

### Notes on the sheet
- Fichier :
- a
- Date :
- Heure :
- Version :
- Auteur :
- Modif.
- b
- c
- d
- Projet :
- No :
- Nb feuilles
- Feuille n°
- Chemin :
- (in symbol CMP-03913-53914525-3) +
- (in symbol CMP-03913-53914615-2) +

### Library data of the parts
C13-C18 C20 = C: as C1 on sheet GeigerChannel
C19 C21 = CMP-03913-53914615-2: Alum. Electrolytic Cap 10UF 50V, 5MM Surface Mount, Lifetime 2000H, +105OC; Impedance: 2.8Ω; Tolerance: 20%; Ripple Current (AC): 95mA; Insulation Resistance: 10MΩ; Life (Hours): 2000hours; ESR (Equivalent Series Resistance): 1.63932Ω; Polarity: Polar; Leakage Current: 5µA; Case/Package: Radial; Max Operating Temperature: 105°C; Height: 5.5mm; Voltage Rating (DC): 50V; REACH SVHC: Unknown; Length: 5.5mm; Width: 5.3mm; Mount: Surface Mount; Min Operating Temperature: -55°C; Ripple Current: 95mA; Diameter: 5mm; RoHS: Compliant; Voltage Rating: 50V; Height - Seated (Max): 5.5118mm
C22 = CMP-03913-53914525-3: WCAP-ASLL Aluminum Electrolytic Capacitors; Life (Hours): 2000hours; Insulation Resistance: 16.6667MΩ; Ripple Current: 60mA; Impedance: 3.9Ω; Leakage Current: 3µA; Voltage Rating (DC): 50V; Polarity: Polar; Tolerance: 20%; Case/Package: Radial; Length: 5.5mm; Height - Seated (Max): 5.5118mm; Height: 5.5mm; Ripple Current (AC): 60mA; REACH SVHC: Unknown; RoHS: Compliant; Voltage Rating: 50V; Mount: Surface Mount; Min Operating Temperature: -55°C; Max Operating Temperature: 105°C; Diameter: 4mm
L2 = Inductor: Code_IEC: 1005; Published: 8-Jun-2000; LatestRevisionDate: 29-May-2009; LatestRevisionNote: IPC-7351 Footprint Added.; PackageReference: 0402-A; Publisher: Altium Limited; PackageDescription: Chip Inductor; Code_JEITA: 0402; Value: 10uH; Supplier 1: RS
R37-R39 = CMP-2001-00528-1: as R1 on sheet GeigerChannel
U4 = CMP-0136-00007-1: Low Quiescent Current LDO, 3-Pin TO-92, Extended TemperatureBAG; PackageReference: TO-92-TO3; PackageDescription: 3-Lead Plastic Transistor Outline (TO) [TO-92]; DatasheetVersion: revB, Feb-2007; PackageVersion: revBB, Aug-2009
U5 = CMP-0388-00116-2: 28 V, 250 mA Switch Boost Converter for LCD and White LED Applications, 1.8 to 6 V, -40 to 85 degC, 5-pin SOT23 (DBV5), Green (RoHS & no Sb/Br); Manufacturer: Texas Instruments; SubFamily: White LED Driver; Vin(Max)(V): 6; Rating: Catalog; Switching Frequency(Max)(kHz): 1000; Dimming: TRUE; Iq(Typ)(mA): 0.028; Vin(Min)(V): 1.8; Iout(Max)(A): 0.05; PackageVersion: 4073253-4/K; PackageDescription: 5-Pin Plastic Small Outline, Body 1.60 Ãƒâ€” 2.90 mm, Pitch 0.95 mm; Mounting Technology: Surface Mount; Topology: Boost; ComponentLink2Description: Datasheet; DatasheetVersion: SLVS413F; ComponentLink3URL: http://www.ti.com/litv/pdf/mpds018i; ComponentLink3Description: Package Specification; Code_JEDEC: MO-178; Eco-Plan: Green (RoHS & no Sb/Br); ComponentLink1URL: http://www.ti.com/; ComponentLink2URL: http://www.ti.com/general/docs/lit/getliterature.tsp?genericPartNumber=TPS61041&fileType=pdf; PackageReference: DBV0005A; PartNumber: TPS61041DBVR; ComponentLink1Description: Manufacturer URL
U6 = CMP-0391-00172-1: -5 V, Buck / Boost Charge Pump, 100 mA, 3.5 to 15 V Input, -40 to 85 degC, 8-pin DIP (P8), Pb-Free (RoHS); Manufacturer: Texas Instruments; Switching Frequency(Max)(kHz): 35; Vin(Min)(V): 3.5; Iout(Max)(A): 0.1; Vout(Min)(V): -4.7; Iq(Typ)(mA): 2.5; Vin(Max)(V): 15; Vout(Max)(V): -5.2; ComponentLink2URL: http://www.ti.com/general/docs/lit/getliterature.tsp?genericPartNumber=LT1054&fileType=pdf; Preset Vout(V): -5; PartNumber: LT1054IPE4; ComponentLink3URL: http://www.ti.com/litv/pdf/mpdi001b; Eco-Plan: Pb-Free (RoHS); PackageDescription: 8-Pin Plastic In-Line, Body 9.59 x 6.35 mm, 2.54 mm Pitch; Code_JEDEC: MS-001; PackageReference: P8; Mounting Technology: Through Hole; PackageVersion: 4040082/E; DatasheetVersion: SLVS033F; ComponentLink3Description: Package Specification; ComponentLink1URL: http://www.ti.com/; ComponentLink1Description: Manufacturer URL; Topology: Buck/Boost; ComponentLink2Description: Datasheet

## Nets that join several sheets
3V3: GeigerChannel (R13.1), SolidStateRadiationChannel (R31.1 U2.5), Mcu (6 pins), Interface (P3.1 R53.2 R54.2), Power (C13.1 C14.1 U4.3)
5V: GeigerChannel (5 pins), SolidStateRadiationChannel (C11.1 C12.1 R28.1 U3.8), Interface (P3.3), Power (6 pins)
15V: Interface (P3.5), Power (7 pins)
-15V: SolidStateRadiationChannel (R24.1 R25.1 R26.1 R27.1), Interface (P3.7), Power (C19.2 U6.5)
GND: GeigerChannel (11 pins), SolidStateRadiationChannel (9 pins), Mcu (15 pins), Interface (16 pins), Power (12 pins)